# EAGLE design LED-Board (EAGLE 9.3.0)
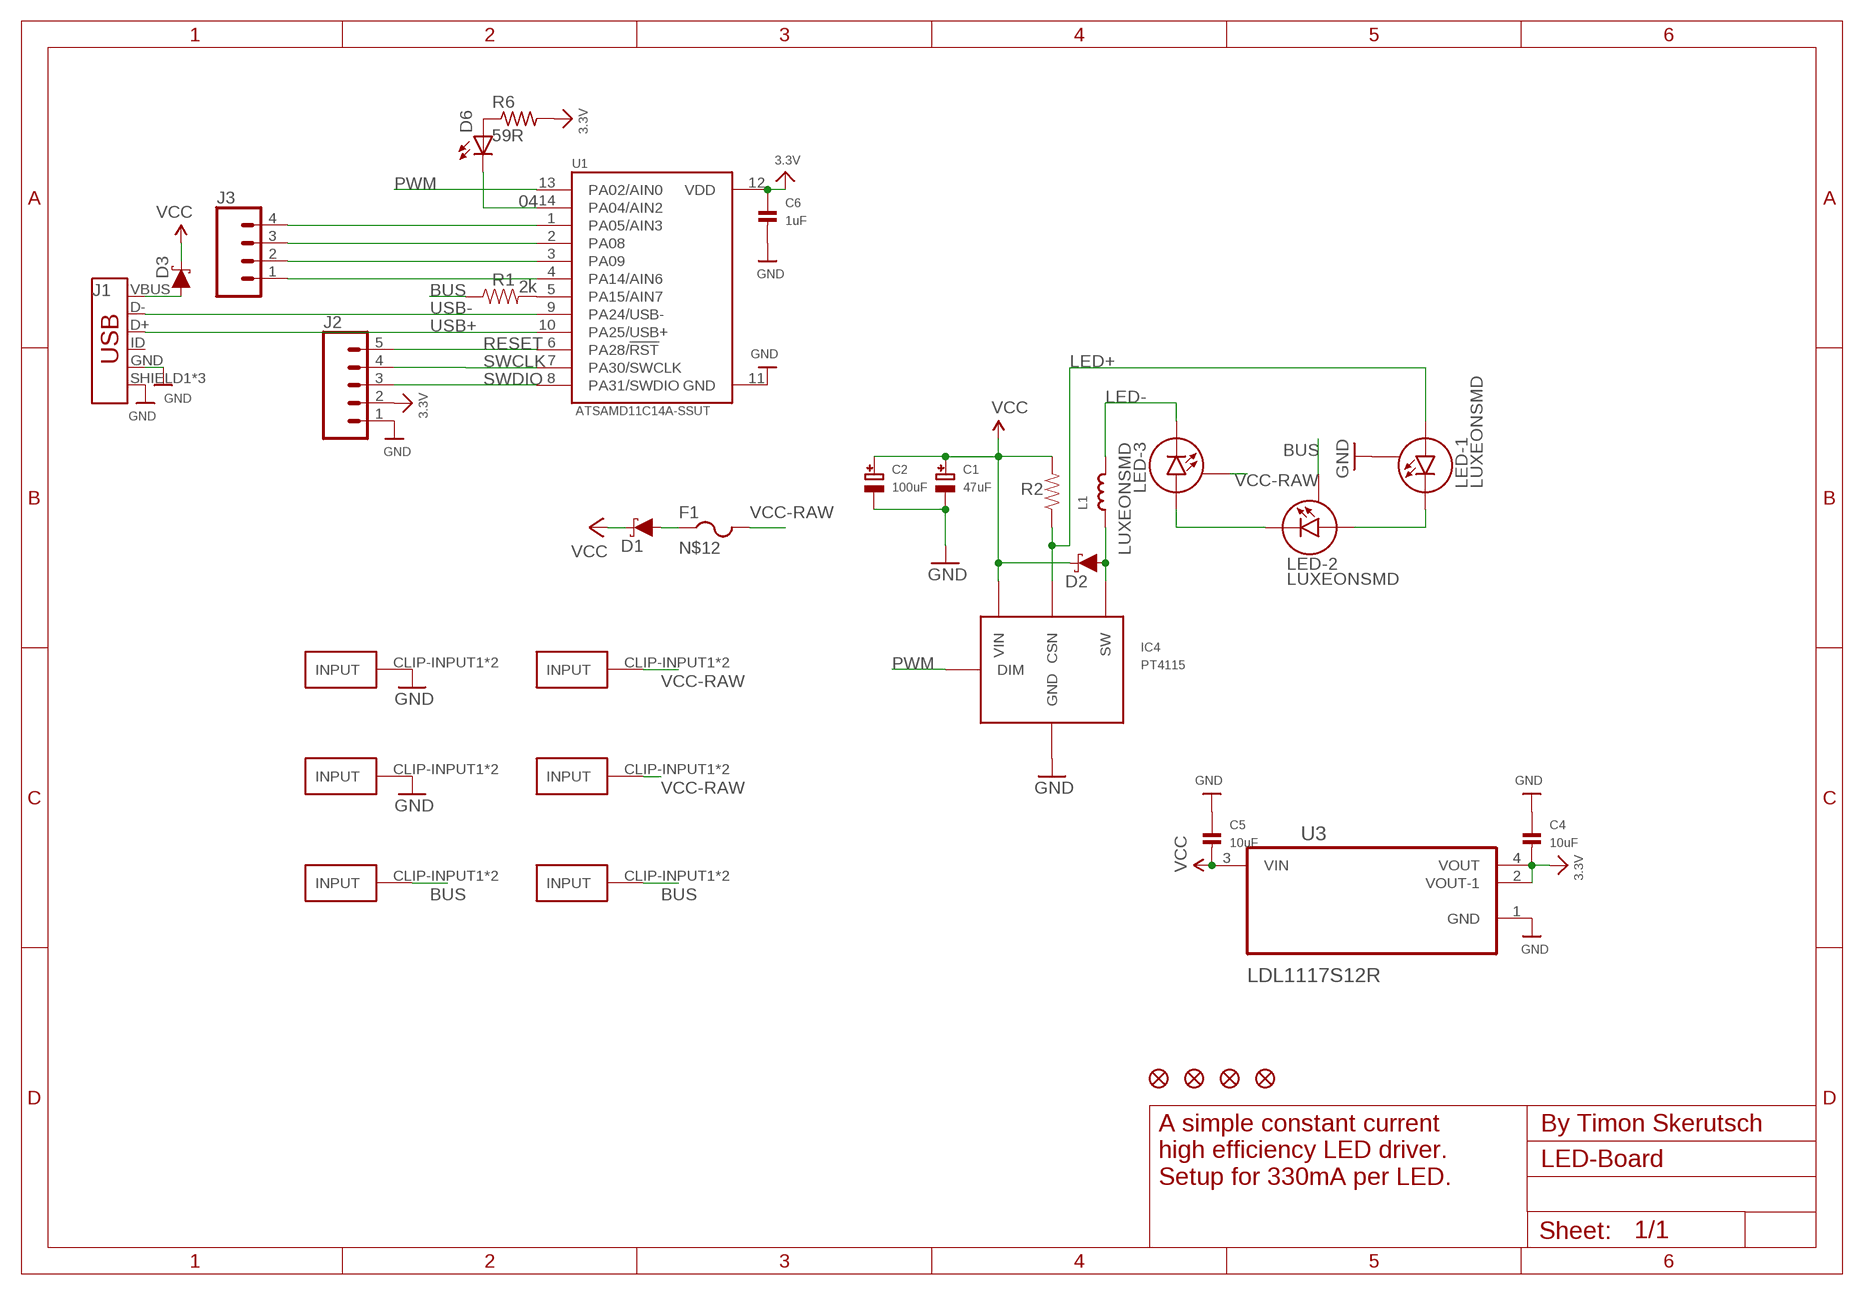
[diagram p0: schematic, sheet 1]

## Parts
C1  47uF  CAP_ELECTROLYTICPANASONIC_D  [PANASONIC_D]
C2  100uF  CAP_ELECTROLYTICPANASONIC_D  [PANASONIC_D]
C4  10uF  CAP_CERAMIC0805  [0805]
C5  10uF  CAP_CERAMIC0603  [0603]
C6  1uF  CAP_CERAMIC0603  [0603]
D1  3A/40V/500mV  DIODE-SCHOTTKY-B340A  [SMA-DIODE]
D2  3A/40V/500mV  DIODE-SCHOTTKY-B340A  [SMA-DIODE]
D3  3A/40V/500mV  DIODE-SCHOTTKY-B340A  [SMA-DIODE]
D6  LEDCHIPLED_0805  [CHIPLED_0805]
F1  TLC-MSMD110/24  PTCFUSE-1812  [1812]
FD1  FIDUCIAL1X2  [FIDUCIAL-1X2]
FD2  FIDUCIAL1X2  [FIDUCIAL-1X2]
FD3  FIDUCIAL1X2  [FIDUCIAL-1X2]
FD4  FIDUCIAL1X2  [FIDUCIAL-1X2]
GND-CLIP  FUSE-HOLDER-5X20MM  [FUSE-HOLDER-5X20MM]
GND-CLIP3  FUSE-HOLDER-5X20MM  [FUSE-HOLDER-5X20MM]
IC4  PT4115  [PT4115]
J1  USB_MICRO-B_FEMALE-SMT  [USB-B-MICRO-SMD]
J2  CONN_05  [1X05]
J3  CONN_04  [1X04]
L1  INDUCTORTDK_VLC6045  [INDUCTOR_6X6MM_TDK_VLC6045]
LED-1  LUXEONSMD  [LUXEON]
LED-2  LUXEONSMD  [LUXEON]
LED-3  LUXEONSMD  [LUXEON]
PWM-CLIP  FUSE-HOLDER-5X20MM  [FUSE-HOLDER-5X20MM]
PWM-CLIP1  FUSE-HOLDER-5X20MM  [FUSE-HOLDER-5X20MM]
R1  2k  RESISTOR1206  [1206]
R2  0.3  RESISTOR1206  [1206]
R6  59R  R-US_R0805  [R0805]
U1  ATSAMD11C14A-SSUT  [SOIC127P600X160-14N]
U3  LDL1117S12R  [SOT230P700X180-4N]
VCC-CLIP  FUSE-HOLDER-5X20MM  [FUSE-HOLDER-5X20MM]
VCC-CLIP3  FUSE-HOLDER-5X20MM  [FUSE-HOLDER-5X20MM]

## Nets
3.3V [VCC]: C4.2 C6.1 J2.2 R6.2 U1.12(VDD) U3.2(VOUT-1) U3.4(VOUT)
04: D6.C U1.14(PA04/AIN2)
BUS: LED-2.S PWM-CLIP1.CLIP-INPUT1(INPUT) PWM-CLIP1.CLIP-INPUT2(INPUT) PWM-CLIP.CLIP-INPUT1(INPUT) PWM-CLIP.CLIP-INPUT2(INPUT) R1.1
GND: C1.- C2.- C4.1 C5.1 C6.2 GND-CLIP3.CLIP-INPUT1(INPUT) GND-CLIP3.CLIP-INPUT2(INPUT) GND-CLIP.CLIP-INPUT1(INPUT) GND-CLIP.CLIP-INPUT2(INPUT) IC4.2(GND) IC4.2A(GND) J1.GND J1.SHIELD1(SHIELD) J1.SHIELD2(SHIELD) J1.SHIELD3(SHIELD) J2.1 LED-1.S U1.11(GND) U3.1(GND)
LED+: IC4.4(CSN) LED-1.A R2.1
LED-: L1.P$2 LED-3.C
N$1: D2.A IC4.1(SW) L1.P$1
N$2: LED-1.C LED-2.A
N$3: LED-2.C LED-3.A
N$4 [VCC]: D3.A J1.VBUS
N$5: R1.2 U1.5(PA15/AIN7)
N$6: D6.A R6.1
N$7: J3.1 U1.4(PA14/AIN6)
N$8: J3.2 U1.3(PA09)
N$9: J3.3 U1.2(PA08)
N$12 [VCC]: D1.A F1.1
N$13: J3.4 U1.1(PA05/AIN3)
PWM: IC4.3(DIM) U1.13(PA02/AIN0)
RESET: J2.5 U1.6(PA28/!RST)
SWCLK: J2.4 U1.7(PA30/SWCLK)
SWDIO: J2.3 U1.8(PA31/SWDIO)
USB+: J1.D+ U1.10(PA25/USB+)
USB-: J1.D- U1.9(PA24/USB-)
VCC [VCC]: C1.+ C2.+ C5.2 D1.C D2.C D3.C IC4.5(VIN) R2.2 U3.3(VIN)
VCC-RAW [VCC]: F1.2 LED-3.S VCC-CLIP3.CLIP-INPUT1(INPUT) VCC-CLIP3.CLIP-INPUT2(INPUT) VCC-CLIP.CLIP-INPUT1(INPUT) VCC-CLIP.CLIP-INPUT2(INPUT)
Unconnected: J1.ID

## Notes on the sheet
- By Timon Skerutsch
- A simple constant current
  high efficiency LED driver.
  Setup for 330mA per LED.

## Library data of the parts
C1 C2 = microbuilder:CAP_ELECTROLYTIC: Electrolytic Capacitors SMT PANASONIC_C - Size C Panasonic Electrolytic Aluminum Capacitor 47µF 16V 20% Electrolytic Capacitor [Digikey: PCE3890TR-ND] PANASONIC_D - Size D Panasonic Electrolytic Aluminum Capacitor 100µF 25V 20% Electrolytic Capacitor [Digikey: PCE3898TR-ND] PTH 3.5 mm grid, 8 mm diameter ... 3.5 mm grid, 10 mm diameter ...
C4-C6 = microbuilder:CAP_CERAMIC: Ceramic Capacitors 0402 - 0402 Surface Mount Capacitors 16pF 50V 5% [Digikey: 445-4899-2-ND] 18pF 50V 5% [Digikey: 490-1281-2-ND] 22pF 50V 5% [Digikey: 490-1283-2-ND] 68pF 50V 5% [Digikey: 490-1289-2-ND] 0.1uF 10V 10% [Digikey: 490-1318-2-ND] 1.0uF 6.3V 10% [Digikey: 490-1320-2-ND] 0603 - 0603 Surface Mount Capacitors 16 pF 50V 5% [Digikey: 445-5051-2-ND] 22 pF 50V [Digikey: PCC220ACVTR-ND] 33 pF 50V 5% [Digikey: 490-1415-1-ND] 56pF 50V 5% [Digikey: 490-1421-1-ND] 220pF 50V 5% [Digikey: 445-1285-1-ND] 680 pF 50V 2200 pF 50V 5% C0G [Digikey: 445-1297-1-ND] 5600 pF 100V 5% X7R [Digikey: 478-3711-1-ND] 0.1 µF 25V 10% [Digikey: PCC2277TR-ND] 0.22 µF 16V 10% X7R [Digikey: 445-1318-1-ND] 1.0 µF 25V 10% [Digikey: 445-5146-2-ND] 0603 - RF Specific 3pF 250V +/-0.1pF RF [Digikey: 712-1347-1-ND] 18 pF 250V 5% [Digikey: 478-3505-1-ND or 712-1322-1-ND] 56 pF 250V 5% C0G RF [Digikey: 490-4867-1-ND] 68 pF 250V RF [Digikey: 490-4868-1-ND] 0805 - 0805 Surface Mount Capacitors 220 pF 250V 2% RF Ceramic Capacitor [Digikey: 712-1398-1-ND] 1000 pF 50V 2% NP0 Ceramic Capacitor [Digikey: 478-3760-1-ND] 0.1 µF 25V 10% Ceramic Capacitor [Digikey: PCC1828TR-ND] 1.0 µF 16V 10% Ceramic Capacitor[Digikey: 490-1691-2-ND] 10.0 µF 10V 10% Ceramic Capacitor[Digikey: 709-1228-1-ND] 10.0 uF 16V 10% Ceramic Capacitor [Digikey: 478-5165-2-ND] 47 uF 6.3V 20% Ceramic Capacitor [Digikey: 587-1779-1-ND or 399-5506-1-ND] 1206 - 1206 Surface Mount Capacitors 47uF 10V 20% Ceramic Capacitor [Digikey: 490-5528-1-ND or 399-5508-1-ND or 445-6010-1-ND] 100uF 6.3V -20%, +80% Y5V Ceramic Capacitor (Digikey: 490-4512-1-ND, Mouser: 81-GRM31CF50J107ZE1L)
D1-D3 = SparkFun-DiscreteSemi:DIODE-SCHOTTKY: Schottky diode A Schottky diode is a semiconductor diode which has a low forward voltage drop and a very fast switching action.; PROD_ID: DIO-09886
D6 = Adafruit:LED: LED OSRAM: - CHIPLED LG R971, LG N971, LY N971, LG Q971, LY Q971, LO R971, LY R971 LH N974, LH R974 LS Q976, LO Q976, LY Q976 LO Q996 - Hyper CHIPLED LW Q18S LB Q993, LB Q99A, LB R99A - SideLED LS A670, LO A670, LY A670, LG A670, LP A670 LB A673, LV A673, LT A673, LW A673 LH A674 LY A675 LS A676, LA A676, LO A676, LY A676, LW A676 LS A679, LY A679, LG A679 - Hyper Micro SIDELED® LS Y876, LA Y876, LO Y876, LY Y876 LT Y87S - SmartLED LW L88C, LW L88S LB L89C, LB L89S, LG L890 LS L89K, LO L89K, LY L89K LS L896, LA L896, LO L896, LY L896 - TOPLED LS T670, LO T670, LY T670, LG T670, LP T670 LSG T670, LSP T670, LSY T670, LOP T670, LYG T670 LG T671, LOG T671, LSG T671 LB T673, LV T673, LT T673, LW T673 LH T674 LS T676, LA T676, LO T676, LY T676, LB T676, LH T676, LSB T676, LW T676 LB T67C, LV T67C, LT T67C, LS T67K, LO T67K, LY T67K, LW E67C LS E67B, LA E67B, LO E67B, LY E67B, LB E67C, LV E67C, LT E67C LW T67C LS T679, LY T679, LG T679 LS T770, LO T770, LY T770, LG T770, LP T770 LB T773, LV T773, LT T773, LW T773 LH T774 LS E675, LA E675, LY E675, LS T675 LS T776, LA T776, LO T776, LY T776, LB T776 LHGB T686 LT T68C, LB T68C - Hyper Mini TOPLED® LB M676 - Mini TOPLED Santana® LG M470 LS M47K, LO M47K, LY M47K Source: http://www.osram.convergy.de/
F1 = Adafruit:PTCFUSE: PTC fuses, resettable thermistors
FD1-FD4 = SparkFun-Aesthetics:FIDUCIAL: Fiducial Alignment Points Point-of-reference for pick-and-place machines and other optical instruments.
GND-CLIP GND-CLIP3 PWM-CLIP PWM-CLIP1 VCC-CLIP VCC-CLIP3 = timon-diverses:FUSE-HOLDER-5X20MM
IC4 = PT4115:PT4115: 30V, 1.2A Step-down High Brightness LED Driver with 5000:1 Dimming PDF: http://www.google.pl/url?sa=t&rct=j&q=PT4115&source=web&cd=1&ved=0CC4QFjAA&url=http%3A%2F%2Fwww.micro-bridge.com%2Fdata%2FCRpowtech%2FPT4115E.pdf&ei=9NbxUKXPJNSzhAem2oGoAQ&usg=AFQjCNEsPWIIWjIVjxpF5YN6SPR3coTTpw&bvm=bv.1357700187,d.d2k
J1 = SparkFun-Connectors:USB_MICRO-B: USB Type Micro-B Connector Male/female and PTH/SMT variants SparkFun Products: SparkFun microB USB Breakout <https://www.sparkfun.com/products/12035> SparkFun USB microB Plug Breakout <https://www.sparkfun.com/products/10031> SparkFun ESP8266 Thing <https://www.sparkfun.com/products/13231>; PROD_ID: CONN-11752
J2 = SparkFun-Connectors:CONN_05: Multi connection point. Often used as Generic Header-pin footprint for 0.1 inch spaced/style header connections On any of the 0.1 inch spaced packages, you can populate with these: Break Away Headers - Straight <https://www.sparkfun.com/products/116> (PRT-00116) Break Away Male Headers - Right Angle <https://www.sparkfun.com/products/553> (PRT-00553) Female Headers <https://www.sparkfun.com/products/115> (PRT-00115) Break Away Headers - Machine Pin <https://www.sparkfun.com/products/117> (PRT-00117) Break Away Female Headers - Swiss Machine Pin <https://www.sparkfun.com/products/743> (PRT-00743) For SCREWTERMINALS and SPRING TERMINALS visit here: Screw Terimnals on SparkFun.com <https://www.sparkfun.com/search/results?term=Screw+Terminals> (5mm/3.5mm/2.54mm spacing) This device is also useful as a general connection point to wire up your design to another part of your project. Our various solder wires solder well into these plated through hole pads. Hook-Up Wire - Assortment (Stranded, 22 AWG) <https://www.sparkfun.com/products/11375> (PRT-11375) Hook-Up Wire - Assortment (Solid Core, 22 AWG) <https://www.sparkfun.com/products/11367> (PRT-11367) View the entire wire category on our website here <https://www.sparkfun.com/categories/141> Special notes: Molex polarized connector foot print use with SKU : PRT-08231 with associated crimp pins and housings. 1MM SMD Version SKU: PRT-10208
J3 = SparkFun-Connectors:CONN_04: Multi connection point. Often used as Generic Header-pin footprint for 0.1 inch spaced/style header connections On any of the 0.1 inch spaced packages, you can populate with these: Break Away Headers - Straight <https://www.sparkfun.com/products/116> (PRT-00116) Break Away Male Headers - Right Angle <https://www.sparkfun.com/products/553> (PRT-00553) Female Headers <https://www.sparkfun.com/products/115> (PRT-00115) Break Away Headers - Machine Pin <https://www.sparkfun.com/products/117> (PRT-00117) Break Away Female Headers - Swiss Machine Pin <https://www.sparkfun.com/products/743> (PRT-00743) For SCREWTERMINALS and SPRING TERMINALS visit here: Screw Terimnals on SparkFun.com <https://www.sparkfun.com/search/results?term=Screw+Terminals> (5mm/3.5mm/2.54mm spacing) This device is also useful as a general connection point to wire up your design to another part of your project. Our various solder wires solder well into these plated through hole pads. Hook-Up Wire - Assortment (Stranded, 22 AWG) <https://www.sparkfun.com/products/11375> (PRT-11375) Hook-Up Wire - Assortment (Solid Core, 22 AWG) <https://www.sparkfun.com/products/11367> (PRT-11367) View the entire wire category on our website here <https://www.sparkfun.com/categories/141> Special notes: Molex polarized connector foot print use with SKU : PRT-08231 with associated crimp pins and housings. 1MM SMD Version SKU: PRT-10208; PROD_ID: CONN-09696
L1 = microbuilder:INDUCTOR: Inductors 0603: 10nH Ceramic Inductor - microwire antenna/RF (Digikey: 712-1434-2-ND) 0805: 560nH Ceramic Inductor - RF (Digikey: 553-1047-1-ND) 270nH Ceramic Inductor - Q = 40@250MHz, +-5%, 1 Ohm DC Resistance (Digikey: 535-10506-2-ND) 1007 (2518 Metric) SMT: 10µH 10% 250mOhm 820mA 1007 Inductor (Digikey: 587-2189-1-ND) 22µH 10% 500mOhm 580mA 1007 Inductor (Digikey: 587-2190-1-ND) 47µH 10% 950mOhm 420mA 1007 Inductor (Digikey: 587-2191-1-ND) 47µH 5% 100mOhm 1A 1008 Inductor (Digikey: 732-1816-1-ND) 5.0x5.0mm (Taiyo Yuden NR5040 Series) 6.8µH 20% 2.3A 64mOhm Inductor (Digikey: 587-2374-2-ND) 5.0x5.0mm (TDK VLC5045 Series) 4.7µH 20% 3.3A 34mOhm Inductor (Digikey: 445-6526-1-ND) 6.8µH 20% 2.7A 46mOhm Inductor (Digikey: 445-6527-1-ND) 6.0x6.0mm (TDK VLC6045 Series) 4.7µH 20% 3.8A 27mOhm Inductor (Digikey: 445-6538-2-ND) 6.8µH 20% 3A 41mOhm Inductor (Digikey: 445-6540-1-ND) 6.2µH 30% 2.2A 45mOhm Inductor (Digikey: SRR5028-6R2YCT-ND) - Not TDK VLC6045 but footprint should match 6.0x6.0mm (TDK SLF6045 Series) 6.8uH 30% 2A 33mOhm Inductor (Digikey: 445-4572-1-ND, Mouser: 810-SLF645T6R8N2R0PF)
LED-1-LED-3 = SparkFun-LED:LUXEON: Luxeon LED This footprint works with the current 1 Watt, 3 Watt, and 5 Watt LEDs. These blindingly bright LEDs generate a lot of heat so the footprint has a large pad under the LED for thermal transfer. Schematic and footprint are proven. Spark Fun Electronics SKU : COM-00603
R1 R2 = SparkFun-Resistors:RESISTOR: Resistor Basic schematic elements and footprints for 0603, 1206, and PTH resistors.
R6 = Adafruit:R-US_: RESISTOR, American symbol
U1 = ATSAMD11C14A-SSUT:ATSAMD11C14A-SSUT: MCU 32-Bit SAM D11 ARM Cortex M0+ RISC 16KB Flash 1.8V/2.5V/3.3V 14-Pin SOIC T/R; AVAILABILITY: Good; DESCRIPTION: Cortex-M0+, 16KB FLASH, 4KB SRAM, USB - 14 SOIC, INDUSTRIAL, GREEN, 1.6-3.6V, 48MHz/ SOIC .150 (SS); MF: Microchip; MP: ATSAMD11C14A-SSUT; PACKAGE: SOIC-14 Microchip; PRICE: 1.18 USD
U3 = LDL1117S12R:LDL1117S12R: None; AVAILABILITY: Good; DESCRIPTION: 1.2 A High PSRR low dropout linear voltage regulator; MF: STMicroelectronics; MP: LDL1117S12R; PACKAGE: SOT-223 STMicroelectronics; PRICE: 0.22 USD

## Net classes
1 VCC: clearance 0.254 mm

## Board
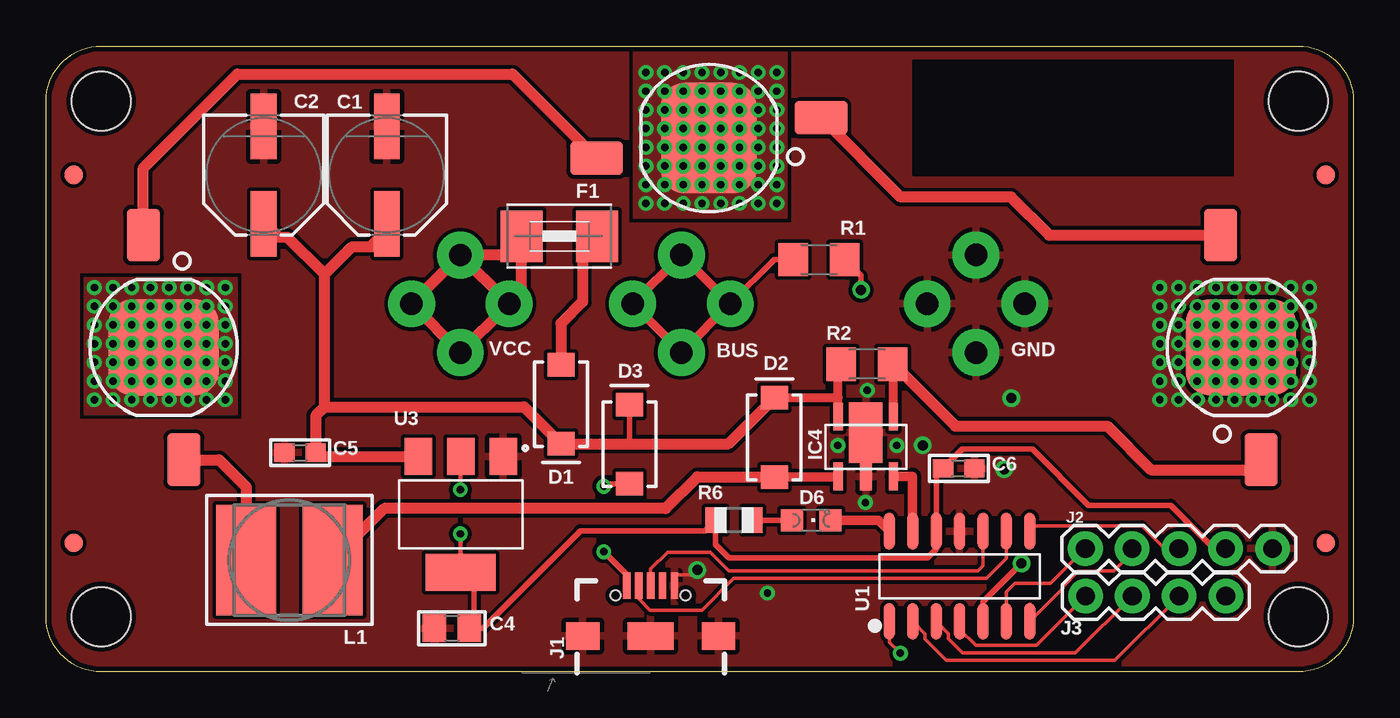
[diagram p1: board, top side]
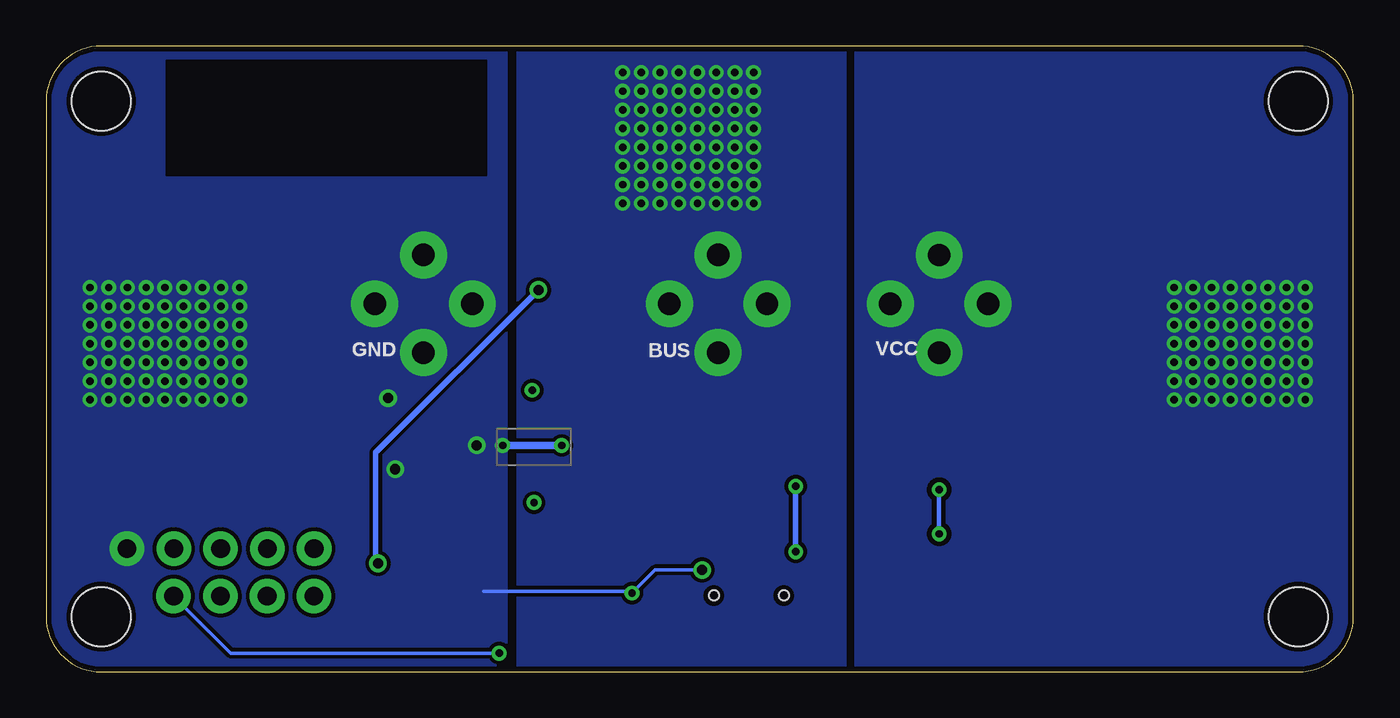
[diagram p2: board, bottom side, seen from below]

Size 71 x 34 mm. Coordinates in mm from the lower left corner, seen from the top.
Outline: 0,3 0,31 arc-90 3,34 68,34 arc-90 71,31 71,3 arc-90 68,0 3,0 arc-90 0,3
Copper layers (1*16): Top 0.035mm / dielectric 1.5mm / Bottom 0.035mm
Design rules "adafruit-modified-for-pcb-ng *": minimum track width 8mil, minimum drill 15.5mil, track to track 8mil, track to pad 8mil, pad to pad 8mil, via to via 8mil, smd to smd 0mil, copper to edge 11mil, drill to drill 8mil, minimum pad ring 10mil, minimum via ring 8mil, stop-mask expansion 0.116840625mm, vias tented up to drill 20mil, thermal gap 10mil
Holes 3.2 mm at 3,3 3,31 68,31 68,3
tRestrict: area 47.1,27 to 64.5,33.2
bRestrict: area 47.1,27 to 64.5,33.2

### Footprints (pad centres in the part's own frame; a part is rotated, then mirrored left to right if it is on the bottom)
PANASONIC_D = smd 3.556 x 1.4: + 2.654,0; - -2.654,0
0805 = smd 1.3 x 1.5: 1 -0.95,0; 2 0.95,0
0603 = smd 1.1 x 1: 1 -0.85,0; 2 0.85,0
SMA-DIODE = smd 1.27 x 1.47: A -2.15,0; C 2.15,0
CHIPLED_0805 = smd 1.2 x 1.2: A 0,-1.05; C 0,1.05
1812 = smd 2.286 x 2.794: 1 -2.046,0; 2 2.046,0
FIDUCIAL-1X2 = smd 1 x 1: 1 0,0
FUSE-HOLDER-5X20MM = drill 1.22 pad 2.54: CLIP-INPUT1 -2.65,0; CLIP-INPUT2 2.65,0
PT4115 = smd 0.5 x 1.5: 1 0,0; 3 3,0; 4 3,3.25; 5 0,3.25 | smd 0.65 x 1.5: 2 1.5,0 | smd 1.8 x 3.3: 2A 1.5,2.375
USB-B-MICRO-SMD = smd 1.45 x 0.4: D+ 2.725,0; D- 2.725,0.65; GND 2.725,-1.3; ID 2.725,-0.65; VBUS 2.725,1.3 | smd 1.5 x 1.8: SHIELD1 0,3.685; SHIELD2 0,-3.685 | smd 1.5 x 2.5: SHIELD3 0,0 | hole 0.55: 2.2,1.9; 2.2,-1.9
1X05 = drill 1.016 pad 1.88: 1 0,0; 2 2.54,0; 3 5.08,0; 4 7.62,0; 5 10.16,0
1X04 = drill 1.016 pad 1.88: 1 0,0; 2 2.54,0; 3 5.08,0; 4 7.62,0
INDUCTOR_6X6MM_TDK_VLC6045 = smd 3.25 x 6: P$1 -2.35,0; P$2 2.35,0
LUXEON = smd 2.85 x 1.8: A -6.1,-1.1; C 6.1,1.1 | smd 5.2 x 6: S 0,0
1206 = smd 1.6 x 1.8: 1 -1.4,0; 2 1.4,0
R0805 = smd 1.1 x 1.4: 1 -1,0; 2 1,0
SOIC127P600X160-14N = smd 2 x 0.6: 1 -2.45,3.81; 2 -2.45,2.54; 3 -2.45,1.27; 4 -2.45,0; 5 -2.45,-1.27; 6 -2.45,-2.54; 7 -2.45,-3.81; 8 2.45,-3.81; 9 2.45,-2.54; 10 2.45,-1.27; 11 2.45,0; 12 2.45,1.27; 13 2.45,2.54; 14 2.45,3.81
SOT230P700X180-4N = smd 1.5 x 2: 1 -2.3,-3.15; 2 0,-3.15; 3 2.3,-3.15 | smd 3.8 x 2: 4 0,3.15

### Placement (x,y rotation side)
C1  18.51,26.99 270 top
C2  11.82,26.98 270 top
C4  22.04,2.38 0 top
C5  13.8,11.91 0 top
C6  49.57,11.05 0 top
D1  27.97,14.54 270 top
D2  39.55,12.74 90 top
D3  31.69,12.37 90 top
D6  41.55,8.24 270 top
F1  27.88,23.67 180 top
FD1  1.5,7 0 top
FD2  1.5,27 0 top
FD3  69.5,27 0 top
FD4  69.5,7 0 top
GND-CLIP  50.5,20 0 bottom
GND-CLIP3  50.5,20 90 bottom
IC4  43.02,10.62 0 top
J1  32.83,1.96 90 top
J2  66.6,6.7 180 top
J3  56.45,4.12 0 top
L1  13.22,6.08 180 top
LED-1  64.88,17.62 90 top
LED-2  36,29 180 top
LED-3  6.39,17.62 270 top
PWM-CLIP  34.5,20 0 bottom
PWM-CLIP1  34.5,20 90 bottom
R1  41.98,22.4 0 top
R2  44.57,16.71 180 top
R6  37.36,8.24 180 top
U1  49.61,5.2 90 top
U3  22.52,8.55 180 top
VCC-CLIP  22.5,20 0 bottom
VCC-CLIP3  22.5,19.99 270 bottom

### Tracks (layer width: path | path; a pad name or v marks a point on that pad's centre or on a via)
3.3V  (via drill 0.39)
  Top 0.254: U3.4 22.52,7.48 v22.5,7.5 | v22.5,9.9 22.5,11.68 U3.2
  Top 0.305: 22.8,5.13 23.24,4.69 23.24,2.63 C4.2 23.72,2.38 29.02,7.67 35.8,7.67 R6.2 36.36,6.93 37.1,6.2 47.87,6.2 48.34,6.67 U1.12 48.34,10.68 C6.1 | C6.1 48.72,11.37 | J2.2 63.42,6.7 61.07,9.05 56.8,9.05 56.6,9.05 53.55,12.1 49.76,12.1 C6.1
  Top 0.508: U3.4 22.8,5.13 22.99,4.94
  Bottom 0.254: v22.5,7.5 v22.5,9.9
04
  Top 0.508: D6.C 45.2,8.24 U1.14
BUS  (via drill 0.4)
  Top 0.305: PWM-CLIP.CLIP-INPUT1 37.21,20.06 39.55,22.4 R1.1
  Top 0.483: PWM-CLIP1.CLIP-INPUT2 | 37.21,20.06 37.21,20.05 PWM-CLIP1.CLIP-INPUT1 PWM-CLIP.CLIP-INPUT2 PWM-CLIP1.CLIP-INPUT2 | PWM-CLIP.CLIP-INPUT1 35.14,22.01 PWM-CLIP1.CLIP-INPUT2
  other vias: 32.58,27.48 32.58,26.47 32.58,25.45 33.59,25.45 34.61,25.45 35.62,25.45 36.64,25.45 36.64,26.47 35.62,26.47 34.61,26.47 33.59,26.47 33.59,27.48 34.61,27.48 35.62,27.48 36.64,27.48 37.66,25.45 37.66,26.47 37.66,27.48 38.67,27.48 38.67,26.47 38.67,25.45 39.69,25.45 39.69,26.47 39.69,27.48 39.69,28.5 38.67,28.5 37.66,28.5 36.64,28.5 35.62,28.5 34.61,28.5 33.59,28.5 32.58,28.5 32.58,29.52 33.59,29.52 34.61,29.52 35.62,29.52 36.64,29.52 37.66,29.52 38.67,29.52 39.69,29.52 39.69,30.53 38.67,30.53 37.66,30.53 36.64,30.53 35.62,30.53 34.61,30.53 33.59,30.53 32.58,30.53 32.58,31.55 33.59,31.55 34.61,31.55 35.62,31.55 36.64,31.55 37.66,31.55 38.67,31.55 39.69,31.55 39.69,32.56 38.67,32.56 37.66,32.56 36.64,32.56 35.62,32.56 34.61,32.56 33.59,32.56 32.58,32.56
  pour Bottom (rank 3, no thermals): 27.63,35.5 27.63,-4 45.37,-4 45.37,35.5
  pour Top (no thermals): 31.94,33.71 40.2,33.71 40.2,24.69 31.94,24.69
GND  (via drill 0.4, 0.55)
  Top 0.203: J1.GND 34.13,5.16 34.23,5.26 35.09,5.26 v35.37,5.54
  Bottom 0.203: 47.24,4.39 39.28,4.39 v39.18,4.28 37.92,5.54 v35.37,5.54
  Bottom 0.406: v46.2,12.3 v43,12.3
  other vias: 52.03,11.01 52.42,14.88 66.58,20.88 67.6,20.88 65.56,20.88 64.55,20.88 63.53,20.88 62.52,20.88 61.5,20.88 67.6,19.86 68.61,20.88 60.48,20.88 60.48,19.86 61.5,19.86 62.52,19.86 63.53,19.86 64.55,19.86 65.56,19.86 66.58,19.86 60.48,18.85 61.5,18.85 62.52,18.85 63.53,18.85 64.55,18.85 65.56,18.85 66.58,18.85 67.6,18.85 68.61,19.86 68.61,18.85 60.48,17.83 61.5,17.83 62.52,17.83 63.53,17.83 64.55,17.83 65.56,17.83 66.58,17.83 67.6,17.83 68.61,17.83 60.48,16.82 61.5,16.82 62.52,16.82 63.53,16.82 64.55,16.82 65.56,16.82 66.58,16.82 67.6,16.82 68.61,16.82 60.48,15.8 61.5,15.8 62.52,15.8 63.53,15.8 64.55,15.8 65.56,15.8 66.58,15.8 67.6,15.8 68.61,15.8 60.48,14.78 61.5,14.78 62.52,14.78 63.53,14.78 64.55,14.78 65.56,14.78 66.58,14.78 67.6,14.78 68.61,14.78 47.62,12.31 44.6,15.3 44.5,9.2
  pour Top (rank 2): -1.12,37.9 71.88,37.9 71.88,-6.2 -1.12,-6.2
  pour Bottom (rank 2, no thermals): 46,-4 46,35.5 71.5,35.5 71.5,-4
LED+
  Top 0.483: IC4.4 46.02,16.71 R2.1
  Top 0.61: 46.02,16.71 49.38,13.35 57.62,13.35 60,10.97 65.94,10.97 65.98,10.94 LED-1.A
LED-
  Top 0.61: LED-3.C 9.39,11.52 10.87,10.05 L1.P$2
N$1
  Top 0.508: D2.A 43.02,10.59 IC4.1
  Top 0.61: L1.P$1 18.36,8.87 33.65,8.87 35.37,10.59 35.38,10.59 D2.A
N$2
  Top 0.61: LED-2.A 46.4,25.8 52.4,25.8 54.48,23.72 LED-1.C
N$3
  Top 0.61: LED-3.A 5.29,27.38 10.39,32.48 25.32,32.48 LED-2.C
N$4  (via drill 0.4)
  Top 0.305: J1.VBUS 31.53,5.29 v30.29,6.53 | v30.29,10.09 30.43,10.22 D3.A
  Bottom 0.305: v30.29,6.53 v30.29,10.09
N$5  (via drill 0.55)
  Top 0.305: R1.2 44.26,21.52 v44.26,20.75 | v52.97,5.89 50.88,3.8 U1.5
  Bottom 0.305: v44.26,20.75 53.1,11.91 53.1,6.02 v52.97,5.89
N$6
  Top 0.305: D6.A R6.1
N$7
  Top 0.203: U1.4 49.61,2.32 50.49,1.44 53.78,1.44 J3.1
N$8
  Top 0.203: U1.3 49.01,2.08 49.01,1.79 49.77,1.03 55.91,1.03 J3.2
N$9
  Top 0.203: U1.2 47.73,2.08 47.73,1.79 48.9,0.63 58.04,0.63 J3.3
N$12
  Top 0.61: F1.1 29.15,22.9 29.15,20.12 27.97,18.94 D1.A
N$13  (via drill 0.4)
  Top 0.203: U1.1 45.8,2.7 45.8,1.61 v46.39,1.02
  Bottom 0.203: v46.39,1.02 60.97,1.02 J3.4
PWM
  Top 0.508: IC4.3 47.05,10.62 47.05,7.66 U1.13
RESET
  Top 0.203: U1.6 52.15,4.35 52.6,4.8 54.54,4.8 J2.5
SWCLK
  Top 0.203: U1.7 55.21,4.53 55.21,4.63 56.03,5.46 56.96,5.46 57,5.5 58,5.5 58.98,6.48 J2.4
  Top 0.305: U1.7 53.42,3.62
SWDIO
  Top 0.203: J2.3 60.74,6.7 59.5,7.95 53.72,7.95 U1.8
USB+
  Top 0.203: U1.10 50.88,5.76 50.6,5.48 37.1,5.48 36.07,6.5 33.74,6.5 32.83,5.59 J1.D+
USB-
  Top 0.203: J1.D- 32.2,4.66 32.2,3.96 32.8,3.35 35.06,3.35 35.07,3.35 35.62,3.35 37.34,5.07 51.06,5.07 52.15,6.16 U1.9
VCC
  Top 0.305: D3.C 31.69,12.39
  Top 0.406: 17.5,23.1 18.5,24.11 C1.+ | 12.8,23.6 12.07,24.33 C2.+
  Top 0.483: R2.2 43.02,16.71 IC4.5 43.02,14.89 D2.C
  Top 0.61: D2.C 37.06,12.39 31.69,12.39 D1.C 25.95,14.4 15.12,14.4 | 15.12,14.4 15.12,21.6 | 15.12,14.4 14.65,13.93 C5.2 14.85,11.7 U3.3 | 15.12,21.6 16.62,23.1 17.5,23.1 18.3,23.1 | 15.12,21.6 13.12,23.6 12.8,23.6 12.4,23.6
VCC-RAW  (via drill 0.4)
  Top 0.483: VCC-CLIP3.CLIP-INPUT2 22.5,17.35 | VCC-CLIP.CLIP-INPUT1 25.04,19.89 25.04,20.11 | VCC-CLIP.CLIP-INPUT2
  Top 0.61: VCC-CLIP3.CLIP-INPUT2 25.04,19.89 | VCC-CLIP3.CLIP-INPUT1 25.04,20.11 | VCC-CLIP3.CLIP-INPUT1 VCC-CLIP.CLIP-INPUT2 | VCC-CLIP.CLIP-INPUT2 22.5,17.35 | VCC-CLIP.CLIP-INPUT1 25.83,20.68 F1.2 24.8,22.64 VCC-CLIP3.CLIP-INPUT1
  other vias: 3.64,19.86 4.65,19.86 5.67,19.86 6.68,19.86 7.7,19.86 8.72,19.86 9.73,19.86 9.73,18.85 8.72,18.85 7.7,18.85 6.68,18.85 5.67,18.85 4.65,18.85 3.64,18.85 3.64,17.83 4.65,17.83 5.67,17.83 6.68,17.83 7.7,17.83 8.72,17.83 9.73,17.83 2.62,17.83 2.62,18.85 2.62,19.86 2.62,16.82 3.64,16.82 4.65,16.82 5.67,16.82 6.68,16.82 7.7,16.82 8.72,16.82 9.73,16.82 9.73,15.8 8.72,15.8 7.7,15.8 6.68,15.8 5.67,15.8 4.65,15.8 3.64,15.8 2.62,15.8 2.62,14.78 3.64,14.78 4.65,14.78 5.67,14.78 6.68,14.78 7.7,14.78 8.72,14.78 9.73,14.78 2.62,20.88 3.64,20.88 4.65,20.88 5.67,20.88 6.68,20.88 7.7,20.88 8.72,20.88 9.73,20.88
  pour Bottom (no thermals): -0.53,35.34 -0.53,-3.91 27.02,-3.91 27.02,35.34
  pour Top (no thermals): 2.1,21.39 10.35,21.39 10.35,14.02 2.1,14.02

### Text on the board
tNames: VCC | BUS | GND
bNames: VCC | BUS | GND